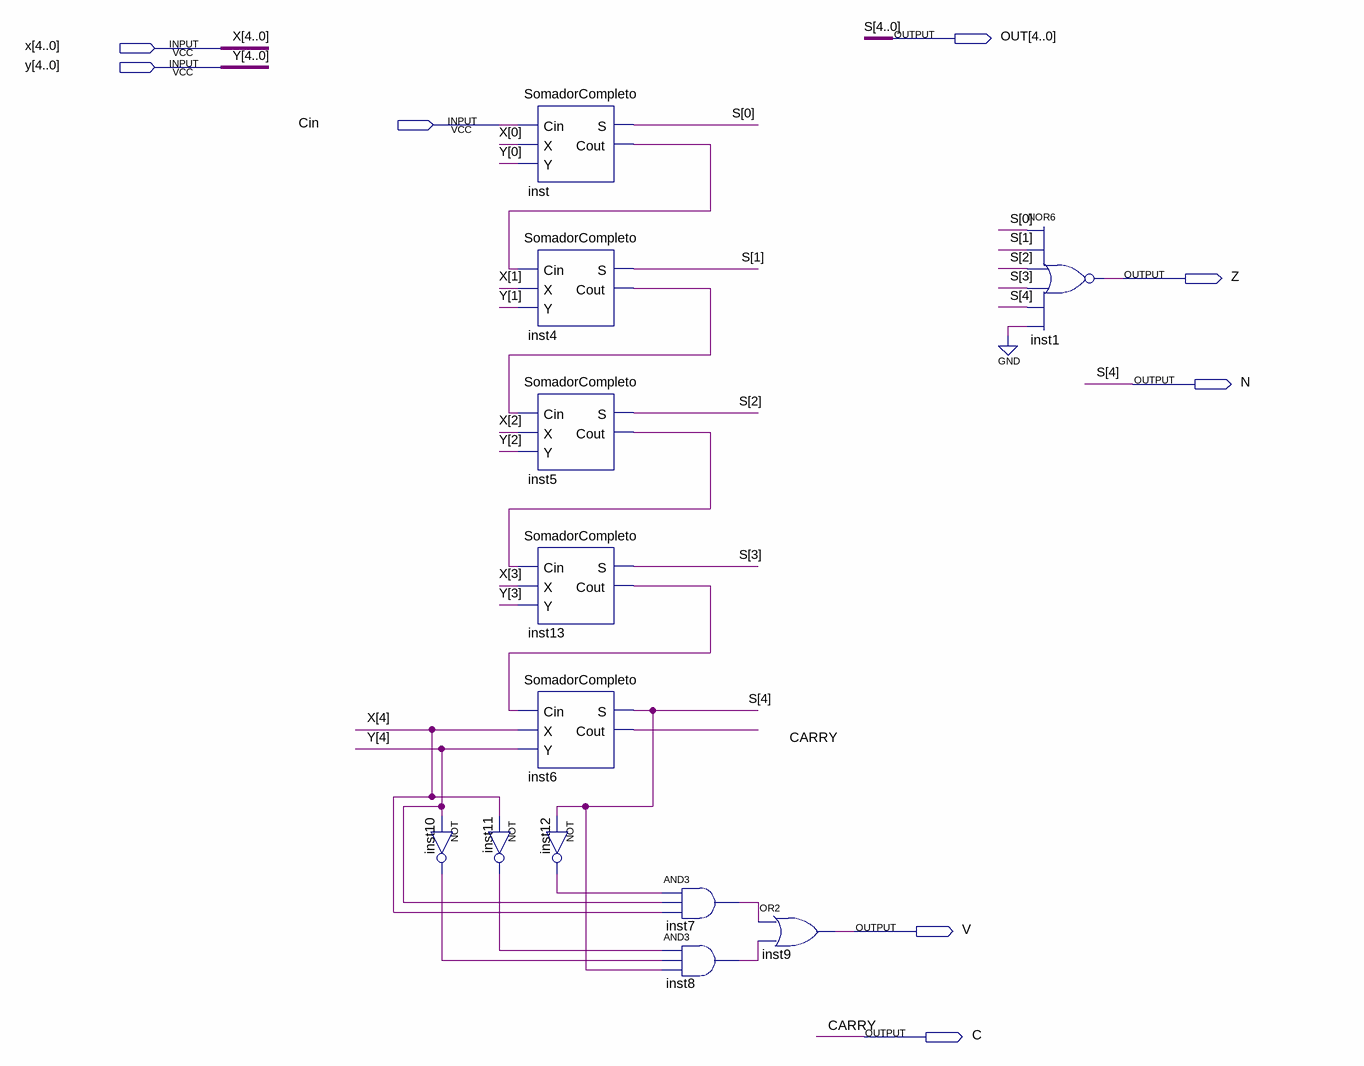
[diagram p0: schematic sheet]
// Quartus schematic Soma.bdf as structural Verilog: 12 symbols, 8 pins
module Soma (
  input  [4:0] x,
  input  [4:0] y,
  input  Cin,
  output [4:0] OUT,
  output Z,
  output N,
  output V,
  output C
);

  wire inst4_cout, inst5_cout, inst7_out, inst8_out, inst10_out, inst11_out, inst12_out, inst13_cout,
       inst_cout;

  not inst10 (inst10_out, y[4]);
  not inst11 (inst11_out, x[4]);
  SomadorCompleto inst (.Cin(Cin), .X(x[0]), .Y(y[0]), .S(OUT[0]), .Cout(inst_cout));
  SomadorCompleto inst4 (.Cin(inst_cout), .X(x[1]), .Y(y[1]), .S(OUT[1]), .Cout(inst4_cout));
  SomadorCompleto inst5 (.Cin(inst4_cout), .X(x[2]), .Y(y[2]), .S(OUT[2]), .Cout(inst5_cout));
  SomadorCompleto inst13 (.Cin(inst5_cout), .X(x[3]), .Y(y[3]), .S(OUT[3]), .Cout(inst13_cout));
  SomadorCompleto inst6 (.Cin(inst13_cout), .X(x[4]), .Y(y[4]), .S(N), .Cout(C));
  not inst12 (inst12_out, N);
  and inst7 (inst7_out, inst12_out, y[4], x[4]);
  and inst8 (inst8_out, inst11_out, inst10_out, N);
  or inst9 (V, inst7_out, inst8_out);
  nor inst1 (Z, OUT[0], OUT[1], OUT[2], OUT[3], N, 1'b0);

  assign OUT[4] = N;

  // Other names for the same wires on the sheet: CARRY = C; S[4:0] = {N, OUT[3:0]}
endmodule
